# Altium schematic sheet franjin.SchDoc
size A4
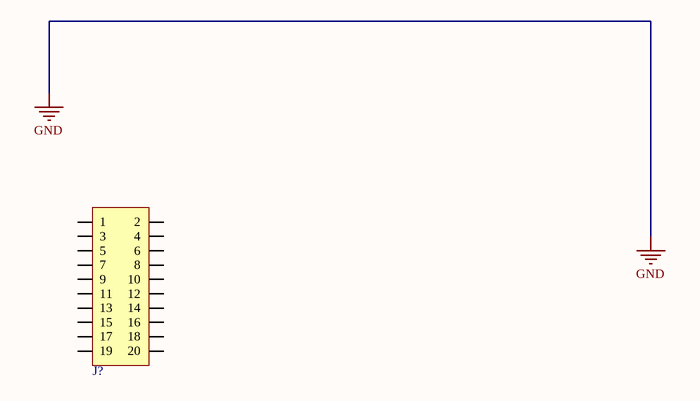
[diagram p0: franjin.SchDoc]

## Parts
J?  Header_20P  [SHDRV20W63P254_10X2_3302X914H881]  (value not drawn)

## Nets

Not connected (* = marked no-connect by the designer): J? 1 2 3 4 5 6 7 8 9 10 11 12 13 14 15 16 17 18 19 20

## Library data of the parts
J? = Header_2x10_Shrouded: Manufacturer Part Number: 5103308-5; ComponentLinkDescription: Datasheet; FR_SN: J-06; Part Number: Header_2x10_Shrouded; Value: Header_20P; Supplier Part Number: 571-5103308-5